# EAGLE design DUTchMate_rev_a (EAGLE 9.6.2)
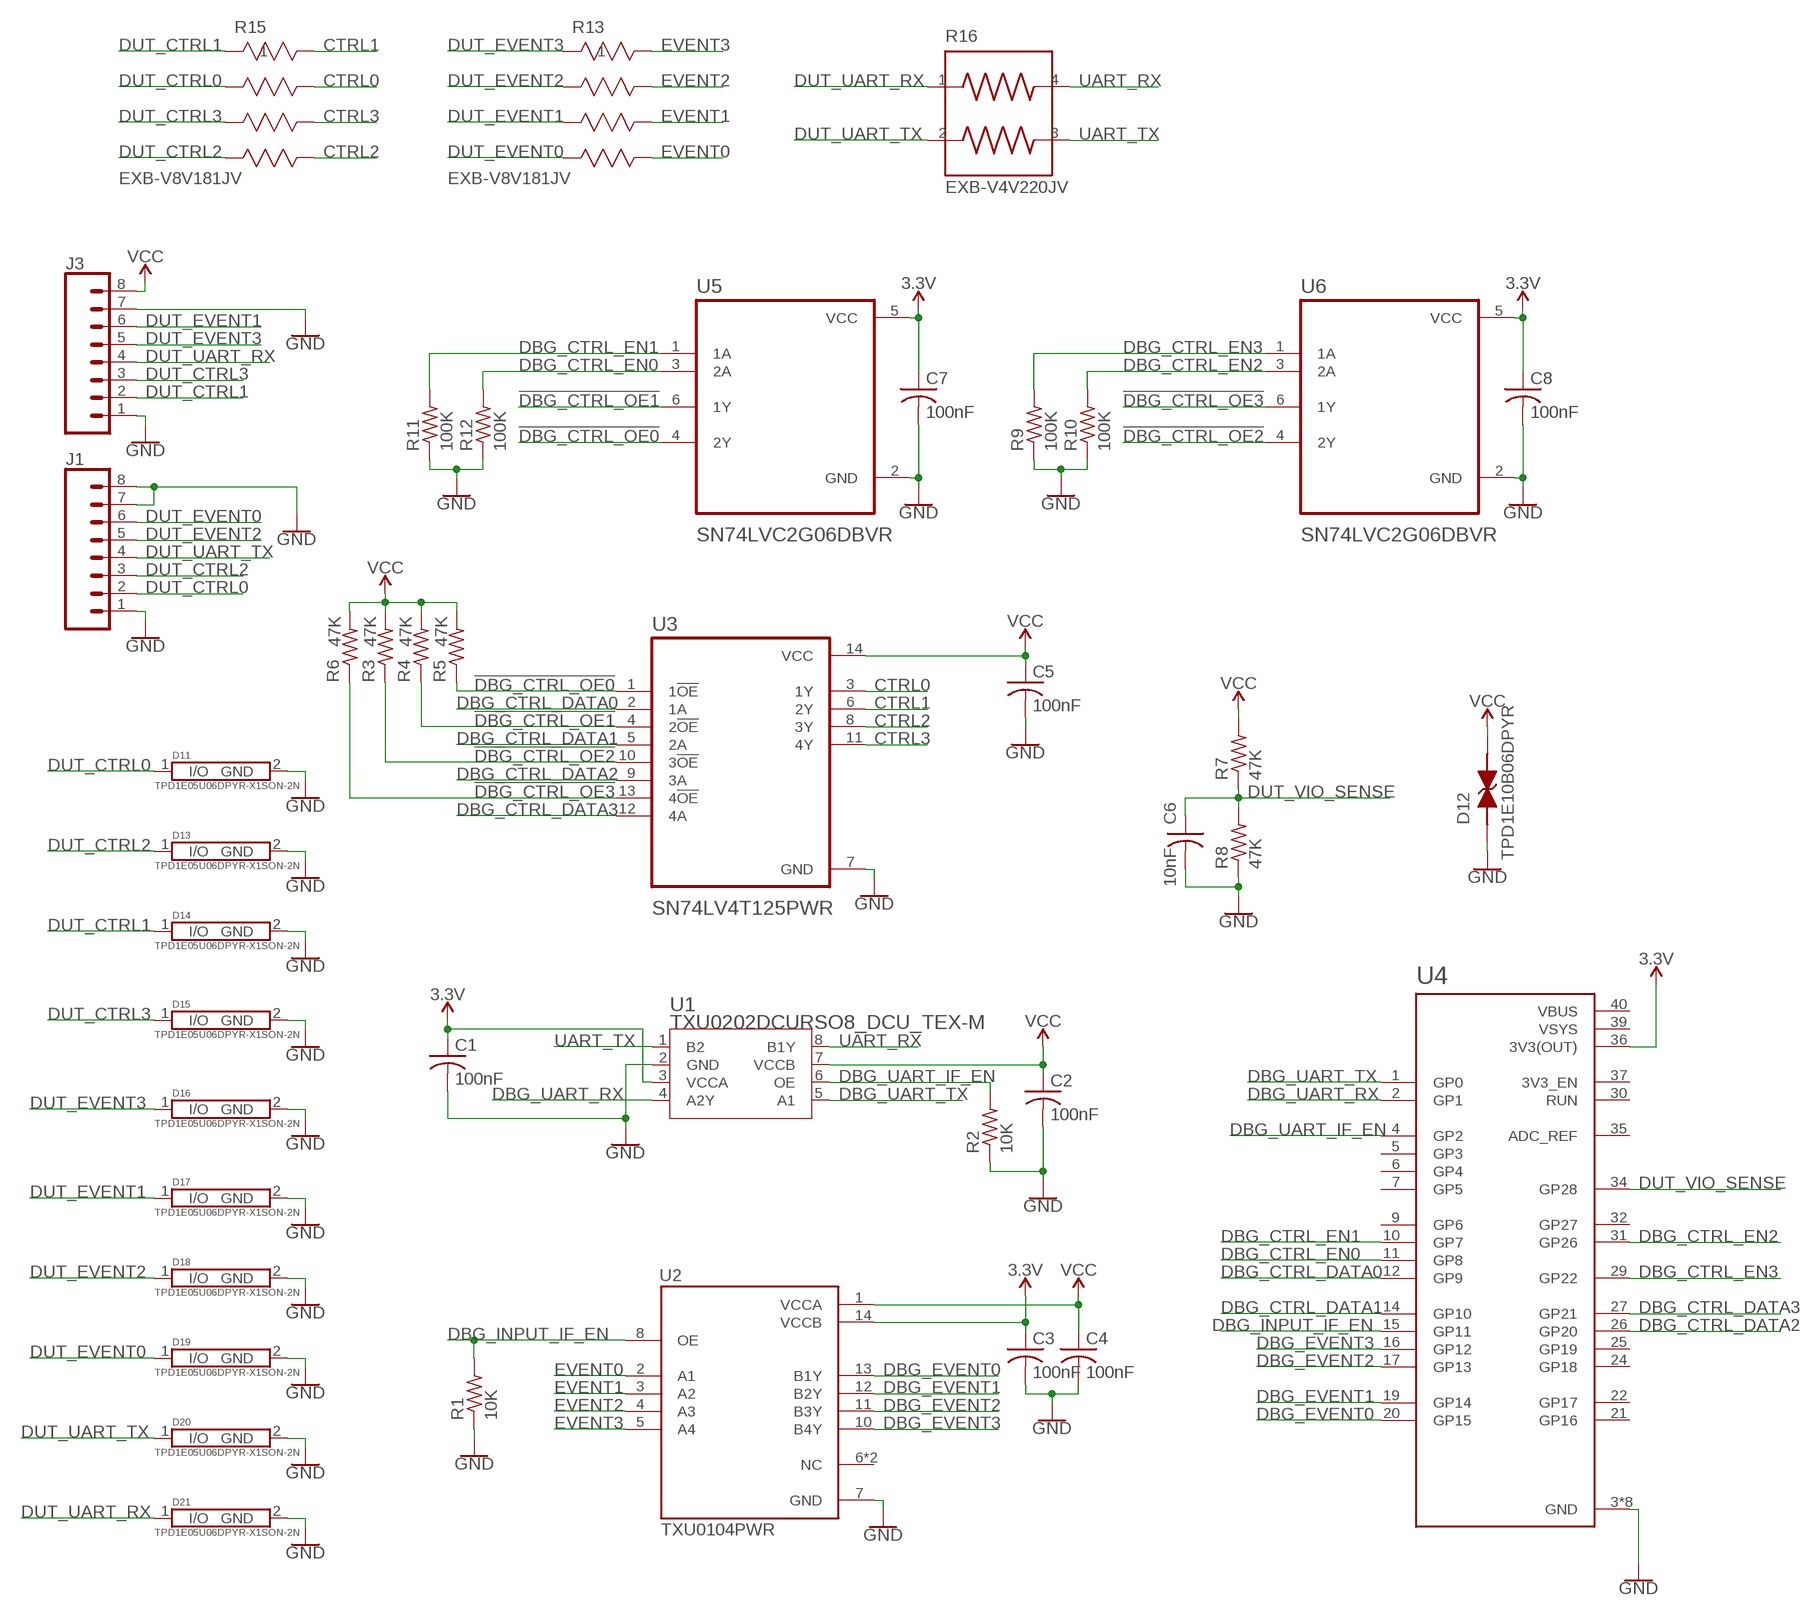
[diagram p0: schematic, sheet 1]

## Parts
C1  100nF  C-USC0805K  [C0805K]
C2  100nF  C-USC0805K  [C0805K]
C3  100nF  C-USC0805K  [C0805K]
C4  100nF  C-USC0805K  [C0805K]
C5  100nF  C-USC0805K  [C0805K]
C6  10nF  C-USC0805K  [C0805K]
C7  100nF  C-USC0805K  [C0805K]
C8  100nF  C-USC0805K  [C0805K]
D11  TPD1E05U06DPYR-X1SON-2N  [X1SON-2N]
D12  TPD1E10B06DPYR  [DIO_TPD1E10B06DPYR]
D13  TPD1E05U06DPYR-X1SON-2N  [X1SON-2N]
D14  TPD1E05U06DPYR-X1SON-2N  [X1SON-2N]
D15  TPD1E05U06DPYR-X1SON-2N  [X1SON-2N]
D16  TPD1E05U06DPYR-X1SON-2N  [X1SON-2N]
D17  TPD1E05U06DPYR-X1SON-2N  [X1SON-2N]
D18  TPD1E05U06DPYR-X1SON-2N  [X1SON-2N]
D19  TPD1E05U06DPYR-X1SON-2N  [X1SON-2N]
D20  TPD1E05U06DPYR-X1SON-2N  [X1SON-2N]
D21  TPD1E05U06DPYR-X1SON-2N  [X1SON-2N]
J1  CONN_08NO_SILK_FEMALE_PTH  [1X08_NO_SILK]
J3  CONN_08NO_SILK_FEMALE_PTH  [1X08_NO_SILK]
R1  10K  R-US_R0603  [R0603]
R2  10K  R-US_R0603  [R0603]
R3  47K  R-US_R0603  [R0603]
R4  47K  R-US_R0603  [R0603]
R5  47K  R-US_R0603  [R0603]
R6  47K  R-US_R0603  [R0603]
R7  47K  R-US_R0603  [R0603]
R8  47K  R-US_R0603  [R0603]
R9  100K  R-US_R0603  [R0603]
R10  100K  R-US_R0603  [R0603]
R11  100K  R-US_R0603  [R0603]
R12  100K  R-US_R0603  [R0603]
R13  EXB-V8V181JV  EXB-V8V102JVEXBV8V_PAN-M  [EXBV8V_PAN-M]
R15  EXB-V8V181JV  EXB-V8V102JVEXBV8V_PAN-M  [EXBV8V_PAN-M]
R16  EXB-V4V220JV  EXB-V4V472JV  [RESCAV80P160X160X70-4N]
U1  TXU0202DCURSO8_DCU_TEX-M  [SO8_DCU_TEX-M]
U2  TXU0104PWR  [SOP65P640X120-14N]
U3  SN74LV4T125PWR  [SOP65P640X120-14N]
U4  RASPBERRY_PICO-NO_DEBUGPICO-PKG-TH-NO_DEBUG  [PICO-PKG-TH]
U5  SN74LVC2G06DBVR  [SOT95P280X145-6N]
U6  SN74LVC2G06DBVR  [SOT95P280X145-6N]

## Nets
3.3V: C1.1 C3.1 C7.1 C8.1 U1.3(VCCA) U2.14(VCCB) U4.36(3V3(OUT)) U5.5(VCC) U6.5(VCC)
!DBG_CTRL_OE0!: R5.1 U3.1(1!OE) U5.4(2Y)
!DBG_CTRL_OE1!: R4.1 U3.4(2!OE) U5.6(1Y)
!DBG_CTRL_OE2!: R3.1 U3.10(3!OE) U6.4(2Y)
!DBG_CTRL_OE3!: R6.1 U3.13(4!OE) U6.6(1Y)
CTRL0: R15.7 U3.3(1Y)
CTRL1: R15.8 U3.6(2Y)
CTRL2: R15.5 U3.8(3Y)
CTRL3: R15.6 U3.11(4Y)
DBG_CTRL_DATA0: U3.2(1A) U4.12(GP9)
DBG_CTRL_DATA1: U3.5(2A) U4.14(GP10)
DBG_CTRL_DATA2: U3.9(3A) U4.26(GP20)
DBG_CTRL_DATA3: U3.12(4A) U4.27(GP21)
DBG_CTRL_EN0: R12.2 U4.11(GP8) U5.3(2A)
DBG_CTRL_EN1: R11.2 U4.10(GP7) U5.1(1A)
DBG_CTRL_EN2: R10.2 U4.31(GP26) U6.3(2A)
DBG_CTRL_EN3: R9.2 U4.29(GP22) U6.1(1A)
DBG_EVENT0: U2.13(B1Y) U4.20(GP15)
DBG_EVENT1: U2.12(B2Y) U4.19(GP14)
DBG_EVENT2: U2.11(B3Y) U4.17(GP13)
DBG_EVENT3: U2.10(B4Y) U4.16(GP12)
DBG_INPUT_IF_EN: R1.2 U2.8(OE) U4.15(GP11)
DBG_UART_IF_EN: R2.2 U1.6(OE) U4.4(GP2)
DBG_UART_RX: U1.4(A2Y) U4.2(GP1)
DBG_UART_TX: U1.5(A1) U4.1(GP0)
DUT_CTRL0: D11.1(I/O) J1.2 R15.2
DUT_CTRL1: D14.1(I/O) J3.2 R15.1
DUT_CTRL2: D13.1(I/O) J1.3 R15.4
DUT_CTRL3: D15.1(I/O) J3.3 R15.3
DUT_EVENT0: D19.1(I/O) J1.6 R13.4
DUT_EVENT1: D17.1(I/O) J3.6 R13.3
DUT_EVENT2: D18.1(I/O) J1.5 R13.2
DUT_EVENT3: D16.1(I/O) J3.5 R13.1
DUT_UART_RX: D21.1(I/O) J3.4 R16.1
DUT_UART_TX: D20.1(I/O) J1.4 R16.2
DUT_VIO_SENSE: C6.1 R7.1 R8.2 U4.34(GP28)
EVENT0: R13.5 U2.2(A1)
EVENT1: R13.6 U2.3(A2)
EVENT2: R13.7 U2.4(A3)
EVENT3: R13.8 U2.5(A4)
GND: C1.2 C2.2 C3.2 C4.2 C5.2 C6.2 C7.2 C8.2 D11.2(GND) D12.1 D13.2(GND) D14.2(GND) D15.2(GND) D16.2(GND) D17.2(GND) D18.2(GND) D19.2(GND) D20.2(GND) D21.2(GND) J1.1 J1.7 J1.8 J3.1 J3.7 R1.1 R2.1 R8.1 R9.1 R10.1 R11.1 R12.1 U1.2(GND) U2.7(GND) U3.7(GND) U4.3(GND) U4.8(GND) U4.13(GND) U4.18(GND) U4.23(GND) U4.28(GND) U4.33(GND) U4.38(GND) U5.2(GND) U6.2(GND)
UART_RX: R16.4 U1.8(B1Y)
UART_TX: R16.3 U1.1(B2)
VCC: C2.1 C4.1 C5.1 D12.2 J3.8 R3.2 R4.2 R5.2 R6.2 R7.2 U1.7(VCCB) U2.1(VCCA) U3.14(VCC)
Unconnected: U2.6(NC) U2.9(NC) U4.5(GP3) U4.6(GP4) U4.7(GP5) U4.9(GP6) U4.21(GP16) U4.22(GP17) U4.24(GP18) U4.25(GP19) U4.30(RUN) U4.32(GP27) U4.35(ADC_REF) U4.37(3V3_EN)

## Power pins joined to a net without a drawn wire
VBUS: U4.40(VBUS)
VSYS: U4.39(VSYS)

## Library data of the parts
C1-C8 = adafruit:C-US: CAPACITOR, American symbol
D11 D13-D21 = TPD1E05U06DPYR:TPD1E05U06DPYR-X1SON-2N: Check availability <https://pricing.snapeda.com/parts/TPD1E05U06DPYR/UMW/view-part?ref=eda>
D12 = TPD1E10B06DPYR:TPD1E10B06DPYR: Check availability <https://pricing.snapeda.com/parts/TPD1E10B06DPYR/Texas%20Instruments/view-part?ref=eda>; AVAILABILITY: In Stock; CHECK_PRICES: https://www.snapeda.com/parts/TPD1E10B06DPYR/Texas+Instruments/view-part/?ref=eda; DESCRIPTION: 12-pF, ±5.5V, ±30-kV ESD protection diode in 0402 and SOD-523 package; MF: Texas Instruments; MP: TPD1E10B06DPYR; PACKAGE: X1SON-2 Texas Instruments; PRICE: None; SNAPEDA_LINK: https://www.snapeda.com/parts/TPD1E10B06DPYR/Texas+Instruments/view-part/?ref=snap
J1 J3 = SparkFun-Connectors:CONN_08: Multi connection point. Often used as Generic Header-pin footprint for 0.1 inch spaced/style header connections On any of the 0.1 inch spaced packages, you can populate with these: Break Away Headers - Straight <https://www.sparkfun.com/products/116> (PRT-00116) Break Away Male Headers - Right Angle <https://www.sparkfun.com/products/553> (PRT-00553) Female Headers <https://www.sparkfun.com/products/115> (PRT-00115) Break Away Headers - Machine Pin <https://www.sparkfun.com/products/117> (PRT-00117) Break Away Female Headers - Swiss Machine Pin <https://www.sparkfun.com/products/743> (PRT-00743) Arduino Stackable Header - 8 Pin <https://www.sparkfun.com/products/9279> (PRT-09279) For SCREWTERMINALS and SPRING TERMINALS visit here: Screw Terimnals on SparkFun.com <https://www.sparkfun.com/search/results?term=Screw+Terminals> (5mm/3.5mm/2.54mm spacing) This device is also useful as a general connection point to wire up your design to another part of your project. Our various solder wires solder well into these plated through hole pads. Hook-Up Wire - Assortment (Stranded, 22 AWG) <https://www.sparkfun.com/products/11375> (PRT-11375) Hook-Up Wire - Assortment (Solid Core, 22 AWG) <https://www.sparkfun.com/products/11367> (PRT-11367) View the entire wire category on our website here <https://www.sparkfun.com/categories/141> Special notes: Molex polarized connector foot print use with SKU : PRT-08231 with associated crimp pins and housings. 1MM SMD Version SKU: PRT-10208 NOTES ON THE VARIANTS LOCK and LOCK_LONGPADS... This footprint was designed to help hold the alignment of a through-hole component (i.e. 6-pin header) while soldering it into place. You may notice that each hole has been shifted either up or down by 0.005 of an inch from it's more standard position (which is a perfectly straight line). This slight alteration caused the pins (the squares in the middle) to touch the edges of the holes. Because they are alternating, it causes a "brace" to hold the component in place. 0.005 has proven to be the perfect amount of "off-center" position when using our standard breakaway headers. Although looks a little odd when you look at the bare footprint, once you have a header in there, the alteration is very hard to notice. Also,if you push a header all the way into place, it is covered up entirely on the bottom side.; PROD_ID: CONN-08438
R1-R12 = adafruit:R-US_: RESISTOR, American symbol
R13 R15 = EXB-V8V:EXB-V8V102JV; COPYRIGHT: Copyright (C) 2026 Ultra Librarian. All rights reserved.; MANUFACTURER_NAME: Panasonic; MANUFACTURER_PART_NUMBER: EXB-V8V102JV
R16 = EXB-V4V472JV:EXB-V4V472JV; CHECK_PRICES: https://www.snapeda.com/parts/EXBV4V472JV/Panasonic/view-part/?ref=eda; DESCRIPTION: 4.7k Ohm ±5% 62.5mW Power Per Element Isolated 2 Resistor Network/Array ±200ppm/°C 0606, Concave; DIGIKEY_PART_NUMBER: Y2472CT-ND; MF: Panasonic; MP: EXBV4V472JV; PACKAGE: None; PURCHASE-URL: https://www.snapeda.com/api/url_track_click_mouser/?unipart_id=6784850&manufacturer=Panasonic&part_name=EXBV4V472JV&search_term=exbv4v; SNAPEDA_LINK: https://www.snapeda.com/parts/EXBV4V472JV/Panasonic/view-part/?ref=snap
U1 = TXU0202:TXU0202DCUR; COPYRIGHT: Copyright (C) 2026 Ultra Librarian. All rights reserved.; DESCRIPTION: Two channel fixed-direction level shifter with channels in opposite direction 8-VSSOP -40 to 125; MANUFACTURER_NAME: Texas Instruments; MANUFACTURER_PART_NUMBER: TXU0202DCUR
U2 = TXU0104PWR:TXU0104PWR: Check availability <https://pricing.snapeda.com/parts/TXU0104PWR/Texas%20Instruments/view-part?ref=eda>; AVAILABILITY: In Stock; CHECK_PRICES: https://www.snapeda.com/parts/TXU0104PWR/Texas+Instruments/view-part/?ref=eda; DESCRIPTION: Four channel unidirectional level shifter; MF: Texas Instruments; MP: TXU0104PWR; PACKAGE: None; PRICE: None; SNAPEDA_LINK: https://www.snapeda.com/parts/TXU0104PWR/Texas+Instruments/view-part/?ref=snap
U3 = SN74LV4T125PWR:SN74LV4T125PWR: Check availability <https://pricing.snapeda.com/parts/SN74LV4T125PWR/Texas%20Instruments/view-part?ref=eda>; AVAILABILITY: In Stock; CHECK_PRICES: https://www.snapeda.com/parts/SN74LV4T125PWR/Texas+Instruments/view-part/?ref=eda; DESCRIPTION: Single Power Supply Quadruple Buffer GATE w/ 3-State Output CMOS Logic Level Shifter; MF: Texas Instruments; MP: SN74LV4T125PWR; PACKAGE: TSSOP-14 Texas Instruments; PRICE: None; SNAPEDA_LINK: https://www.snapeda.com/parts/SN74LV4T125PWR/Texas+Instruments/view-part/?ref=snap
U4 = RpiPico:RASPBERRY_PICO-NO_DEBUG
U5 U6 = SN74LVC2G06DBVR:SN74LVC2G06DBVR: Check availability <https://pricing.snapeda.com/parts/SN74LVC2G06DBVR/Texas%20Instruments/view-part?ref=eda>; AVAILABILITY: In Stock; CHECK_PRICES: https://www.snapeda.com/parts/SN74LVC2G06DBVR/Texas+Instruments/view-part/?ref=eda; DESCRIPTION: 2-ch, 1.65-V to 5.5-V inverters with open-drain outputs; MF: Texas Instruments; MP: SN74LVC2G06DBVR; PACKAGE: SOT-23-6 Texas Instruments; PRICE: None; PURCHASE-URL: https://www.snapeda.com/api/url_track_click_mouser/?unipart_id=314160&manufacturer=Texas Instruments&part_name=SN74LVC2G06DBVR&search_term=None; SNAPEDA_LINK: https://www.snapeda.com/parts/SN74LVC2G06DBVR/Texas+Instruments/view-part/?ref=snap

## Board
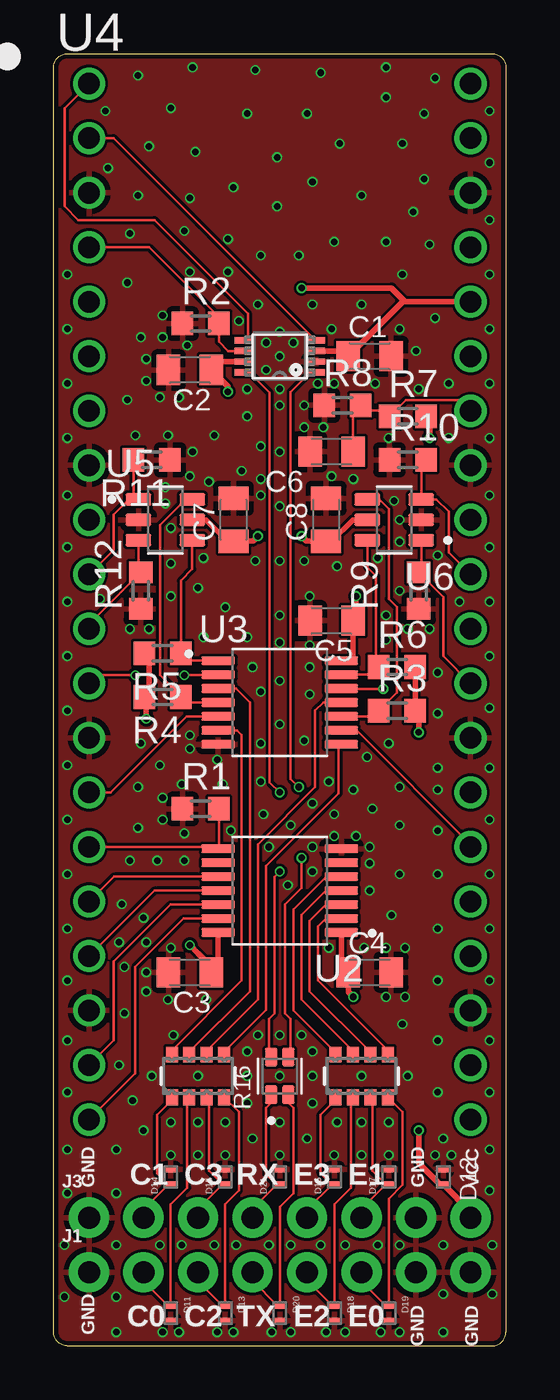
[diagram p1: board, top side]
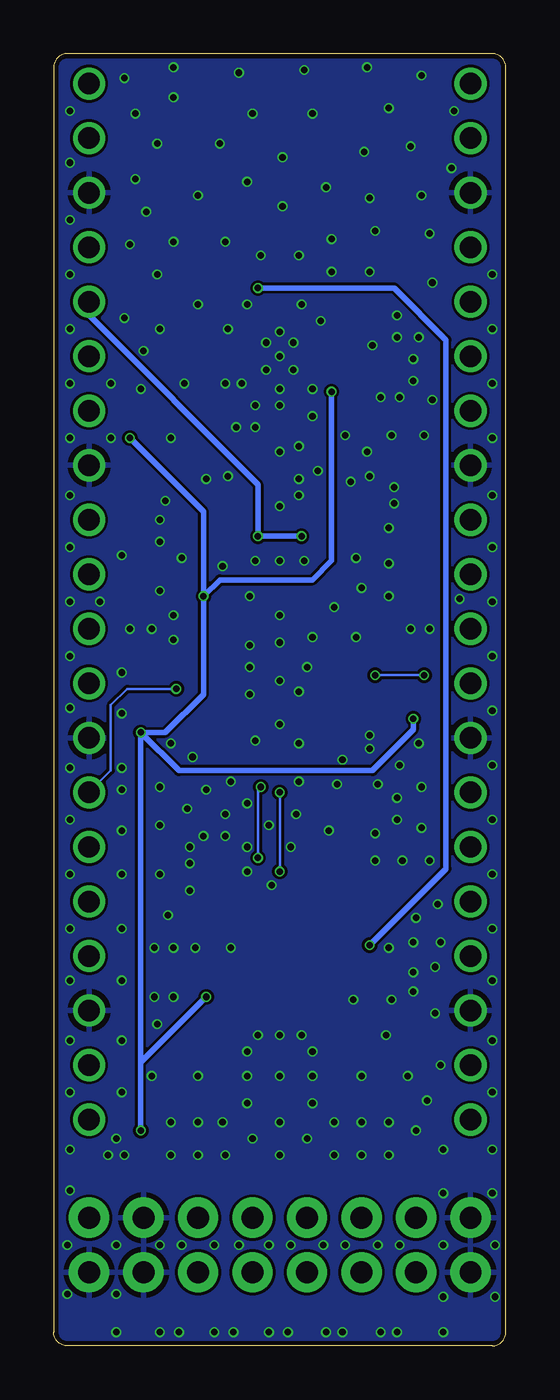
[diagram p2: board, bottom side, seen from below]

Size 21.08 x 60.2 mm. Coordinates in mm from the lower left corner, seen from the top.
Outline: 0,0.63 0,59.56 arc-90 0.64,60.2 20.45,60.2 arc-90 21.08,59.56 21.08,0.63 arc-90 20.45,0 0.64,0 arc-90 0,0.63
Copper layers (1*16): Top 0.035559375mm / dielectric 1.6mm / Bottom 0.035559375mm
Design rules "jlcpcb-2layers *": minimum track width 5mil, minimum drill 12mil, track to track 5mil, track to pad 5mil, pad to pad 5mil, via to via 5mil, smd to smd 5mil, copper to edge 8mil, drill to drill 6mil, minimum pad ring 5mil, minimum via ring 3mil, stop-mask expansion 2.5mil, vias tented up to drill 13mil, thermal gap 10mil

### Footprints (pad centres in the part's own frame; a part is rotated, then mirrored left to right if it is on the bottom)
C0805K = smd 1.1 x 1.4: 1 -1,0; 2 1,0
X1SON-2N = smd 0.3 x 0.5: 1 -0.35,0; 2 0.35,0
DIO_TPD1E10B06DPYR = smd 0.3 x 0.5: 1 -0.35,0; 2 0.35,0
1X08_NO_SILK = drill 1.016 pad 1.88: 1 0,0; 2 2.54,0; 3 5.08,0; 4 7.62,0; 5 10.16,0; 6 12.7,0; 7 15.24,0; 8 17.78,0
R0603 = smd 1 x 1.1: 1 -0.85,0; 2 0.85,0
EXBV8V_PAN-M = smd 0.737 x 0.559: 1 -0.991,1.219; 2 -0.991,0.406; 3 -0.991,-0.406; 4 -0.991,-1.219; 5 0.991,-1.219; 6 0.991,-0.406; 7 0.991,0.406; 8 0.991,1.219
RESCAV80P160X160X70-4N = smd 0.87 x 0.59: 1 -0.88,0.4; 2 -0.88,-0.4; 3 0.88,-0.4; 4 0.88,0.4
SO8_DCU_TEX-M = smd 0.85 x 0.3: 1 -1.676,0.75; 2 -1.676,0.25; 3 -1.676,-0.25; 4 -1.676,-0.75; 5 1.676,-0.75; 6 1.676,-0.25; 7 1.676,0.25; 8 1.676,0.75
SOP65P640X120-14N = smd 1.57 x 0.41: 1 -2.87,1.95; 2 -2.87,1.3; 3 -2.87,0.65; 4 -2.87,0; 5 -2.87,-0.65; 6 -2.87,-1.3; 7 -2.87,-1.95; 8 2.87,-1.95; 9 2.87,-1.3; 10 2.87,-0.65; 11 2.87,0; 12 2.87,0.65; 13 2.87,1.3; 14 2.87,1.95
PICO-PKG-TH = drill 1: 1 2.54,49.53; 2 2.54,46.99; 3 2.54,44.45; 4 2.54,41.91; 5 2.54,39.37; 6 2.54,36.83; 7 2.54,34.29; 8 2.54,31.75; 9 2.54,29.21; 10 2.54,26.67; 11 2.54,24.13; 12 2.54,21.59; 13 2.54,19.05; 14 2.54,16.51; 15 2.54,13.97; 16 2.54,11.43; 17 2.54,8.89; 18 2.54,6.35; 19 2.54,3.81; 20 2.54,1.27; 21 20.32,1.27; 22 20.32,3.81; 23 20.32,6.35; 24 20.32,8.89; 25 20.32,11.43; 26 20.32,13.97; 27 20.32,16.51; 28 20.32,19.05; 29 20.32,21.59; 30 20.32,24.13; 31 20.32,26.67; 32 20.32,29.21; 33 20.32,31.75; 34 20.32,34.29; 35 20.32,36.83; 36 20.32,39.37; 37 20.32,41.91; 38 20.32,44.45; 39 20.32,46.99; 40 20.32,49.53
SOT95P280X145-6N = smd 1.21 x 0.58: 1 -1.255,0.95; 2 -1.255,0; 3 -1.255,-0.95; 4 1.255,-0.95; 5 1.255,0; 6 1.255,0.95

### Placement (x,y rotation side)
C1  14.73,46.1 0 top
C2  6.35,45.47 180 top
C3  6.35,17.4 180 top
C4  14.73,17.4 0 top
C5  12.95,33.78 180 top
C6  12.95,41.66 180 top
C7  8.38,38.48 90 top
C8  12.7,38.48 90 top
D11  5.46,1.52 270 top
D12  18.16,7.87 270 top
D13  8,1.52 270 top
D14  5.46,7.87 90 top
D15  8,7.87 90 top
D16  13.08,7.87 90 top
D17  15.62,7.87 90 top
D18  13.08,1.52 270 top
D19  15.62,1.52 270 top
D20  10.54,1.52 270 top
D21  10.54,7.87 90 top
J1  1.65,3.43 0 top
J3  1.65,5.97 0 top
R1  6.86,25.02 0 top
R2  6.86,47.62 0 top
R3  16,29.59 0 top
R4  5.08,30.23 180 top
R5  5.08,32.26 180 top
R6  16,31.62 0 top
R7  16.51,43.31 0 top
R8  13.46,43.82 0 top
R9  17.02,35.18 90 top
R10  16.51,41.27 0 top
R11  4.57,41.27 180 top
R12  4.06,35.18 90 top
R13  14.35,12.57 90 top
R15  6.73,12.57 90 top
R16  10.54,12.57 90 top
U1  10.54,46.1 180 top
U2  10.54,21.21 180 top
U3  10.54,29.97 0 top
U4  -0.89,9.27 0 top
U5  5.21,38.48 0 top
U6  15.88,38.48 180 top

### Tracks (layer width: path | path; a pad name or v marks a point on that pad's centre or on a via)
3.3V  (via drill 0.3)
  Top 0.254: U2.14 7.67,17.72 C3.1 7.35,17.65 6.73,18.27 6.73,18.29 v6.35,18.67 | v9.53,37.72 9.29,37.48 C7.1 8.11,37.48 7.11,38.48 U5.5 | v11.56,37.72 11.79,37.48 C8.1 12.95,37.48 13.95,38.48 U6.5 | U1.3 13.48,46.35 C1.1 16.27,48.64 U4.36 16.38,48.64 15.75,49.28 v11.56,49.28
  Bottom 0.254: v9.53,37.72 v11.56,37.72 11.56,40.13 19.43,48.01 U4.36 | v6.35,18.67 2.79,22.23 2.79,46.86 5.21,49.28 v11.56,49.28
!DBG_CTRL_OE0!
  Top 0.127: U5.4 6.46,36.18 5.93,35.65 R5.1 6.01,32.34 6.43,31.92 U3.1
!DBG_CTRL_OE1!
  Top 0.127: U5.6 6.16,39.43 4.95,38.23 4.95,31.24 5.93,30.27 R4.1 6.18,29.97 U3.4
!DBG_CTRL_OE2!
  Top 0.127: U3.10 14.88,29.32 R3.1 16,30.44 16,34.42 15.62,34.8 15.62,38.99 15.18,39.43 U6.4
!DBG_CTRL_OE3!
  Top 0.127: U3.13 14.8,31.27 R6.1 15.03,31.75 15.03,35.86 14.62,36.26 U6.6
CTRL0
  Top 0.127: U3.3 8.49,30.62 9.14,29.97 9.14,16.51 6.33,13.69 R15.7
CTRL1
  Top 0.127: U3.6 8.54,28.67 8.76,28.45 8.76,17.02 5.51,13.77 R15.8
CTRL2
  Top 0.127: U3.8 13.28,27.9 13.28,25.74 9.91,22.36 9.91,15.65 7.95,13.69 R15.5
CTRL3
  Top 0.127: U3.11 12.57,29.97 12.19,29.59 12.19,26.03 9.53,23.37 9.53,16.13 7.14,13.74 R15.6
DBG_CTRL_DATA0  (via drill 0.3)
  Top 0.127: U3.2 7.64,31.24 v6.1,31.24 | v3.81,31.24 2.03,31.24 U4.12
  Bottom 0.127: v6.1,31.24 v3.81,31.24
DBG_CTRL_DATA1
  Top 0.127: U4.14 2.67,25.78 6.21,29.32 U3.5
DBG_CTRL_DATA2
  Top 0.127: U3.9 14.13,28.67 19.43,23.37 U4.26
DBG_CTRL_DATA3  (via drill 0.3)
  Top 0.127: v15.37,30.61 13.43,30.61
  Top 0.152: U3.12 13.43,30.61
  Bottom 0.127: U4.27 18.41,26.8 18.41,29.84 17.65,30.61 v15.37,30.61
DBG_CTRL_EN0
  Top 0.127: U5.3 3.95,36.14 R12.2 1.65,33.62 U4.11
DBG_CTRL_EN1
  Top 0.127: R11.2 3.72,39.66 U5.1 3.95,39.5 3.56,39.5 2.79,38.73 2.79,37.08 U4.10
DBG_CTRL_EN2
  Top 0.127: R10.2 17.13,40.82 U6.3 17.85,39.43 18.41,38.86 18.41,36.96 U4.31
DBG_CTRL_EN3
  Top 0.127: U6.1 17.13,36.14 R9.2 18.16,34.89 18.16,32.13 U4.29
DBG_EVENT0
  Top 0.127: U4.20 3.81,12.7 3.81,17.65 6.07,19.91 U2.13
DBG_EVENT1
  Top 0.127: U4.19 2.79,14.22 2.79,17.91 5.45,20.56 U2.12
DBG_EVENT2
  Top 0.127: U2.11 4.7,21.21 U4.17
DBG_EVENT3
  Top 0.127: U4.16 2.81,21.86 U2.10
DBG_INPUT_IF_EN
  Top 0.127: 2.29,23.24 | U4.15 2.29,23.24 | 2.29,23.24 7.59,23.24 U2.8 7.71,23.2 R1.2
DBG_UART_IF_EN
  Top 0.127: U1.6 8.13,46.35 7.71,46.77 7.71,47.5 | 7.71,47.5 R2.2 | 7.71,47.5 7.75,47.54 7.75,47.88 4.45,51.18 U4.4
DBG_UART_RX
  Top 0.127: U4.2 2.79,56.26 12.2,46.85 U1.4
DBG_UART_TX
  Top 0.127: U4.1 0.51,57.66 0.51,53.09 1.14,52.45 4.7,52.45 9.05,48.09 9.05,46.91 8.99,46.85 U1.5
DUT_CTRL0
  Top 0.127: J1.2 4.19,3.02 5.33,1.87 D11.1 5.46,6.6 6.23,7.37 6.23,11.49 R15.2
DUT_CTRL1
  Top 0.127: J3.2 4.19,6.35 5.37,7.52 D14.1 5.33,7.52 4.83,8.03 4.83,10.77 5.51,11.46 R15.1
DUT_CTRL2
  Top 0.127: J1.3 6.73,3.02 7.87,1.87 D13.1 8,6.6 8.64,7.24 8.64,10.9 R15.4
DUT_CTRL3
  Top 0.127: 7.87,7.52 7.24,8.16 7.24,11.49 R15.3 | 7.87,7.52 D15.1 | J3.3 6.73,6.38 7.87,7.52
DUT_EVENT0
  Top 0.127: J1.6 14.35,3.02 15.49,1.87 D19.1 15.62,6.86 16.26,7.49 16.26,10.9 R13.4
DUT_EVENT1
  Top 0.127: J3.6 14.35,6.38 15.49,7.52 | 15.49,7.52 D17.1 | 15.49,7.52 14.85,8.16 14.85,11.49 R13.3
DUT_EVENT2
  Top 0.127: J1.5 11.81,3.05 12.99,1.87 D18.1 13.08,6.6 13.85,7.37 13.85,11.49 R13.2
DUT_EVENT3
  Top 0.127: J3.5 11.81,6.35 12.99,7.52 | 12.99,7.52 12.95,7.52 12.45,8.03 12.45,10.77 13.13,11.46 R13.1 | 12.99,7.52 D16.1
DUT_UART_RX
  Top 0.127: R16.1 10.14,11.31 9.91,11.08 9.91,8 10.4,7.51 | J3.4 9.27,6.38 10.4,7.51 | 10.4,7.51 10.41,7.52 D21.1
DUT_UART_TX
  Top 0.127: R16.2 10.94,11.31 11.18,11.08 11.18,7.11 10.54,6.48 D20.1 10.45,1.87 9.27,3.05 J1.4
DUT_VIO_SENSE
  Top 0.127: C6.1 13.95,43.46 R8.2 14.57,43.56 15.41,43.56 R7.1 16.42,44.07 18.92,44.07 U4.34
EVENT0
  Top 0.127: U2.2 12.69,19.91 12.32,19.54 12.32,17.02 15.57,13.77 R13.5
EVENT1
  Top 0.127: U2.3 12.69,20.56 11.93,19.8 11.93,16.52 14.76,13.69 R13.6
EVENT2
  Top 0.127: U2.4 12.7,21.21 11.56,20.07 11.56,16.13 13.95,13.74 R13.7
EVENT3
  Top 0.127: U2.5 12.72,21.86 11.18,20.32 11.18,15.62 13.13,13.67 R13.8
GND  (via drill 0.3)
  other vias: 16.13,21.97 14.73,23.24 13.08,23.75 15.49,16.26 15.49,18.54 16.13,26.03 5.33,16.13 4.32,17.4 9.02,13.72 5.08,25.53 6.1,23.88 5.97,26.16 6.35,27.81 7.62,27.3 9.27,31.62 11.94,31.62 11.94,30.35 9.65,28.07 9.65,30.48 16.26,14.99 15.11,4.7 12.83,26.29 12.06,22.1 4.32,16.51 10.54,14.48 12.45,4.7 0.64,11.81 2.92,9.14 0.64,14.22 0.64,17.02 0.64,19.43 0.64,21.97 0.64,24.51 0.64,32.13 0.64,34.67 0.64,37.21 0.64,39.62 0.64,42.29 0.64,44.83 0.64,47.37 0.64,49.91 5.08,48.01 4.32,44.96 14.99,44.83 10.54,47.24 10.54,39.12 8.64,47.75 10.54,46.1 9.91,46.74 11.18,46.74 9.91,45.47 11.18,45.47 10.54,44.58 16.13,37.47 8.76,40.77 9.65,41.91 6.73,35.31 12.57,42.8 14.6,27.43 6.35,28.45 4.06,28.07 5.08,24.51 6.1,22.61 3.56,22.61 16.51,12.57 10.54,8.89 20.32,11.81 20.32,14.22 20.32,17.02 20.32,19.43 20.32,21.97 20.32,24.51 20.32,9.14 18.16,0.63 18.16,2.41 5.97,4.7 17.91,11.81 6.73,10.41 8.51,4.7 7.49,4.7 4.95,4.7 13.08,8.89 9.02,12.57 10.03,4.7 5.46,10.41 11.05,4.7 6.73,8.89 17.91,19.43 17.91,21.97 15.75,20.07 14.73,22.48 14.1,23.75 9.78,24.77 9.65,26.29 16.13,24.26 17.91,24 14.86,25.02 13.08,24.77 11.05,24.26 11.94,34.93 10.54,32.77 11.68,36.58 17.02,44.58 17.78,47.88 12.32,44.83 6.35,40.51 13.08,44.83 16.76,52.83 3.43,49.53 15.49,51.44 12.06,48.51 11.43,50.8 7.24,40.26 16.89,46.36 15.49,58.17 17.78,59.06 18.92,34.67 9.65,50.8 4.95,27.05 4.06,46.99 10.41,53.09 3.56,51.82 9.4,59.44 2.54,54.86 5.46,57.66 8.38,53.98 3.94,59.18 14.35,53.59 6.48,59.56 12.45,59.31 2.41,57.53 17.27,57.4 15.49,59.56 13.33,56.01 20.32,57.53 20.32,55.12 20.32,52.45 20.32,49.91 20.32,47.37 20.32,44.83 20.32,42.29 20.32,39.62 20.32,37.21 20.32,34.67 20.32,32.13 20.32,29.72 20.32,26.92 17.53,33.4 18.41,44.83 6.35,53.47 18.41,42.29 11.68,43.82 12.06,54.23 16.13,47.37 9.02,43.31 9.02,44.58 17.53,51.31 10.54,41.66 3.94,53.59 6.22,46.61 9.65,39.62 5.33,42.42 3.43,44.07 5.21,40.01 9.53,48.51 6.48,41.66 5.08,46.99 10.54,34.04 10.54,43.82 3.81,42.42 15.88,39.37 16.13,35.18 17.91,31.37 7.87,26.16 8.26,24 12.06,23.24 5.46,18.54 3.05,18.8 10.54,30.99 8,34.42 10.54,36.58 10.54,28.96 10.92,21.46 12.06,25.27 10.03,23.24 5.46,38.1 2.16,34.8 5.46,36.45 5.46,34.93 4.45,33.4 3.56,33.4 15.49,34.04 15.11,36.7 15.49,32.89 6.6,55.63 6.1,51.94 8.13,51.56 4.32,45.97 10.41,55.37 11.81,57.4 16.26,56.01 9.02,57.4 17.27,54.36 6.99,36.7 5.21,39.24 9.02,33.02 11.68,28.19 15.62,28.07 17.91,25.91 17.91,26.92 13.97,25.91 17.91,29.46 14.73,21.21 16.38,18.54 16.38,16.26 3.94,24.13 3.94,26.03 6.99,33.02 9.4,36.58 13.21,36.32 9.65,40.39 16.51,33.4 16.13,38.48 11.68,42.8 15.62,8.89 0.64,7.11 8,8.89 2.92,7.11 11.81,9.65 13.59,4.7 17.78,8.89 4.83,22.61 4.19,19.94 3.18,20.57 4.32,18.8 3.3,17.65 3.3,15.49 3.05,13.08 17.91,14.22 10.54,12.57 13.08,51.44 12.95,47.37 6.73,12.57 2.92,4.7 5.46,8.89 0.51,4.7 0.51,2.29 0.64,9.14 12.06,12.57 2.92,0.63 17.91,17.02 13.97,40.39 10.54,10.41 14.48,18.54 17.91,36.83 8.13,50.04 16.26,49.91 14.35,48.51 9.53,14.48 8,10.41 12.83,18.54 4.95,44.2 5.84,44.2 6.35,50.04 7.49,42.42 16.13,4.7 18.16,4.7 20.45,4.7 20.32,7.24 20.45,2.41 4.19,10.03 13.21,10.41 15.62,10.41 14.35,10.41 14.35,8.89 2.92,2.29 5.08,0.63 5.84,0.63 7.62,0.63 8.38,0.63 10.16,0.63 11.05,0.63 12.7,0.63 13.59,0.63 15.24,0.63 16.13,0.63 7.11,16.13 9.02,11.3 12.06,11.3 4.57,12.57 5.59,14.48 9.27,9.65 14.35,12.57 3.68,11.43 18.54,8.89 18.16,9.65 11.94,32.64 15.62,42.29 4.45,55.88 0.64,27.05 0.64,29.59 12.95,40.51 12.06,13.72 11.56,14.48
  pour Top: -0.89,-1.14 -0.89,61.09 22.1,61.09 22.1,-1.14
  pour Bottom: -0.89,-1.14 -0.89,61.09 22.1,61.09 22.1,-1.14
UART_RX  (via drill 0.3)
  Top 0.127: v10.54,22.1 10.29,21.84 10.29,15.49 10.03,15.24 10.03,13.56 R16.4 | U1.8 9.12,45.35 10.07,44.4 10.07,26.25 v10.54,25.78
  Bottom 0.127: v10.54,25.78 v10.54,22.1
UART_TX  (via drill 0.3)
  Top 0.127: v11.43,26.03 11.05,26.42 11.05,44.44 11.96,45.35 U1.1 | v11.56,22.73 11.56,21.34 10.79,20.57 10.79,15.49 11.05,15.24 11.05,13.56 R16.3
  Bottom 0.127: v11.43,26.03 11.56,25.91 v11.56,22.73
VCC  (via drill 0.3)
  Top 0.254: U2.1 13.41,17.72 C4.1 13.73,16.49 v13.97,16.26 | R6.2 R3.2 16.98,29.46 16.98,29.43 17.02,29.39 v17.02,28.58 | R5.2 4.45,32.04 4.45,30.44 R4.2 4.32,30.14 v4.32,29.21 | U1.7 7.74,45.85 C2.1 8.13,44.69 v8.13,44.45 | v17.53,42.29 17.53,43.14 R7.2 | U3.14 13.74,31.92 13.95,32.13 C5.1 14.1,33.93 v14.1,34.93 | v17.02,10.03 17.02,8.51 18,7.52 D12.2 19.43,6.25 J3.8
  Bottom 0.254: v14.1,34.93 14.1,38.86 v17.53,42.29 | v4.32,29.21 4.32,28.7 6.22,26.8 15.24,26.8 v17.02,28.58 | 17.02,13.21 v17.02,28.58 | v14.1,34.93 14.1,30.35 15.88,28.58 v17.02,28.58 | v8.13,44.45 8.13,36.58 9.02,35.69 13.33,35.69 v14.1,34.93 | v13.97,16.26 17.02,13.21 | v17.02,10.03 17.02,13.21

### Text on the board
tPlace: GND | C1 | C3 | RX | E3 | E1 | GND | VCC | GND | GND | GND | C0 | C2 | TX | E2 | E0